# Altium schematic sheet pic33.SchDoc
size A
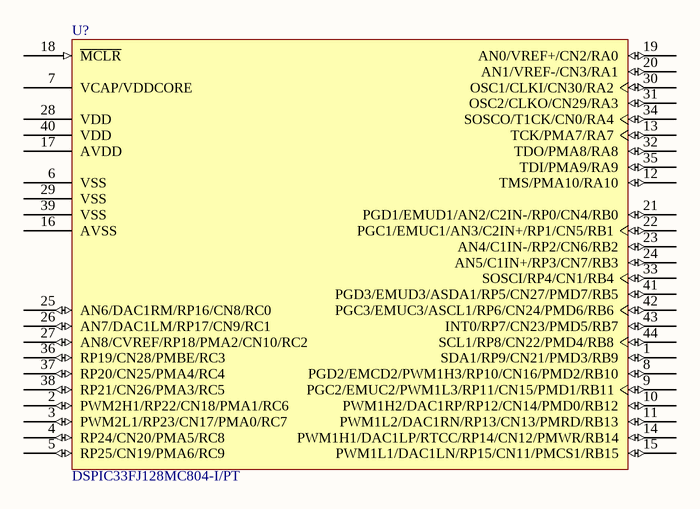
[diagram p0: pic33.SchDoc]

## Parts
U?  DSPIC33FJ128MC804-I/PT  [TQFP-PT44_N]

## Nets

Not connected (* = marked no-connect by the designer): U? 1(SDA1/RP9/CN21/PMD3/RB9) 2(PWM2H1/RP22/CN18/PMA1/RC6) 3(PWM2L1/RP23/CN17/PMA0/RC7) 4(RP24/CN20/PMA5/RC8) 5(RP25/CN19/PMA6/RC9) 6(VSS) 7(VCAP/VDDCORE) 8(PGD2/EMCD2/PWM1H3/RP10/CN16/PMD2/RB10) 9(PGC2/EMUC2/PWM1L3/RP11/CN15/PMD1/RB11) 10(PWM1H2/DAC1RP/RP12/CN14/PMD0/RB12) 11(PWM1L2/DAC1RN/RP13/CN13/PMRD/RB13) 12(TMS/PMA10/RA10) 13(TCK/PMA7/RA7) 14(PWM1H1/DAC1LP/RTCC/RP14/CN12/PMWR/RB14) 15(PWM1L1/DAC1LN/RP15/CN11/PMCS1/RB15) 16(AVSS) 17(AVDD) 18(~{MCLR}) 19(AN0/VREF+/CN2/RA0) 20(AN1/VREF-/CN3/RA1) 21(PGD1/EMUD1/AN2/C2IN-/RP0/CN4/RB0) 22(PGC1/EMUC1/AN3/C2IN+/RP1/CN5/RB1) 23(AN4/C1IN-/RP2/CN6/RB2) 24(AN5/C1IN+/RP3/CN7/RB3) 25(AN6/DAC1RM/RP16/CN8/RC0) 26(AN7/DAC1LM/RP17/CN9/RC1) 27(AN8/CVREF/RP18/PMA2/CN10/RC2) 28(VDD) 29(VSS) 30(OSC1/CLKI/CN30/RA2) 31(OSC2/CLKO/CN29/RA3) 32(TDO/PMA8/RA8) 33(SOSCI/RP4/CN1/RB4) 34(SOSCO/T1CK/CN0/RA4) 35(TDI/PMA9/RA9) 36(RP19/CN28/PMBE/RC3) 37(RP20/CN25/PMA4/RC4) 38(RP21/CN26/PMA3/RC5) 39(VSS) 40(VDD) 41(PGD3/EMUD3/ASDA1/RP5/CN27/PMD7/RB5) 42(PGC3/EMUC3/ASCL1/RP6/CN24/PMD6/RB6) 43(INT0/RP7/CN23/PMD5/RB7) 44(SCL1/RP8/CN22/PMD4/RB8)

## Library data of the parts
U? = DSPIC33FJ128MC804-I/PT: High-Performance 16-bit Digital Signal Controller, 128 KB Flash, 16 KB RAM, 44-Pin TQFP, Industrial Temperature; Published: 29-Jan-2009; LatestRevisionDate: 02-Dec-2009; LatestRevisionNote: Updated to datasheet revision D, Nov-2009; DatasheetVersion: revD, Nov-2009; PackageVersion: revBB, Aug-2009; PackageReference: TQFP-PT44; Publisher: Altium Limited; PackageDescription: 44-Lead Plastic Thin Quad Flatpack (PT) - 10x10x1mm Body, 2.00mm [TQFP]; Supplier 1: Digi-Key; Supplier Part Number 1: DSPIC33FJ128MC804-I/PT-ND; Supplier 2: Farnell; Supplier Part Number 2: 1576810; Code_JEDEC: MS-026; ComponentLink1Description: Datasheet; ComponentLink1URL: http://ww1.microchip.com/downloads/en/DeviceDoc/70291D.pdf; ComponentLink2Description: Packaging Specification; ComponentLink2URL: http://www.microchip.com/stellent/groups/techpub_sg/documents/packagingspec/en012702.pdf; ComponentLink3Description: Microchip.com Home; ComponentLink3URL: http://www.microchip.com/